# EAGLE design Steckkarte (EAGLE 9.5.2)
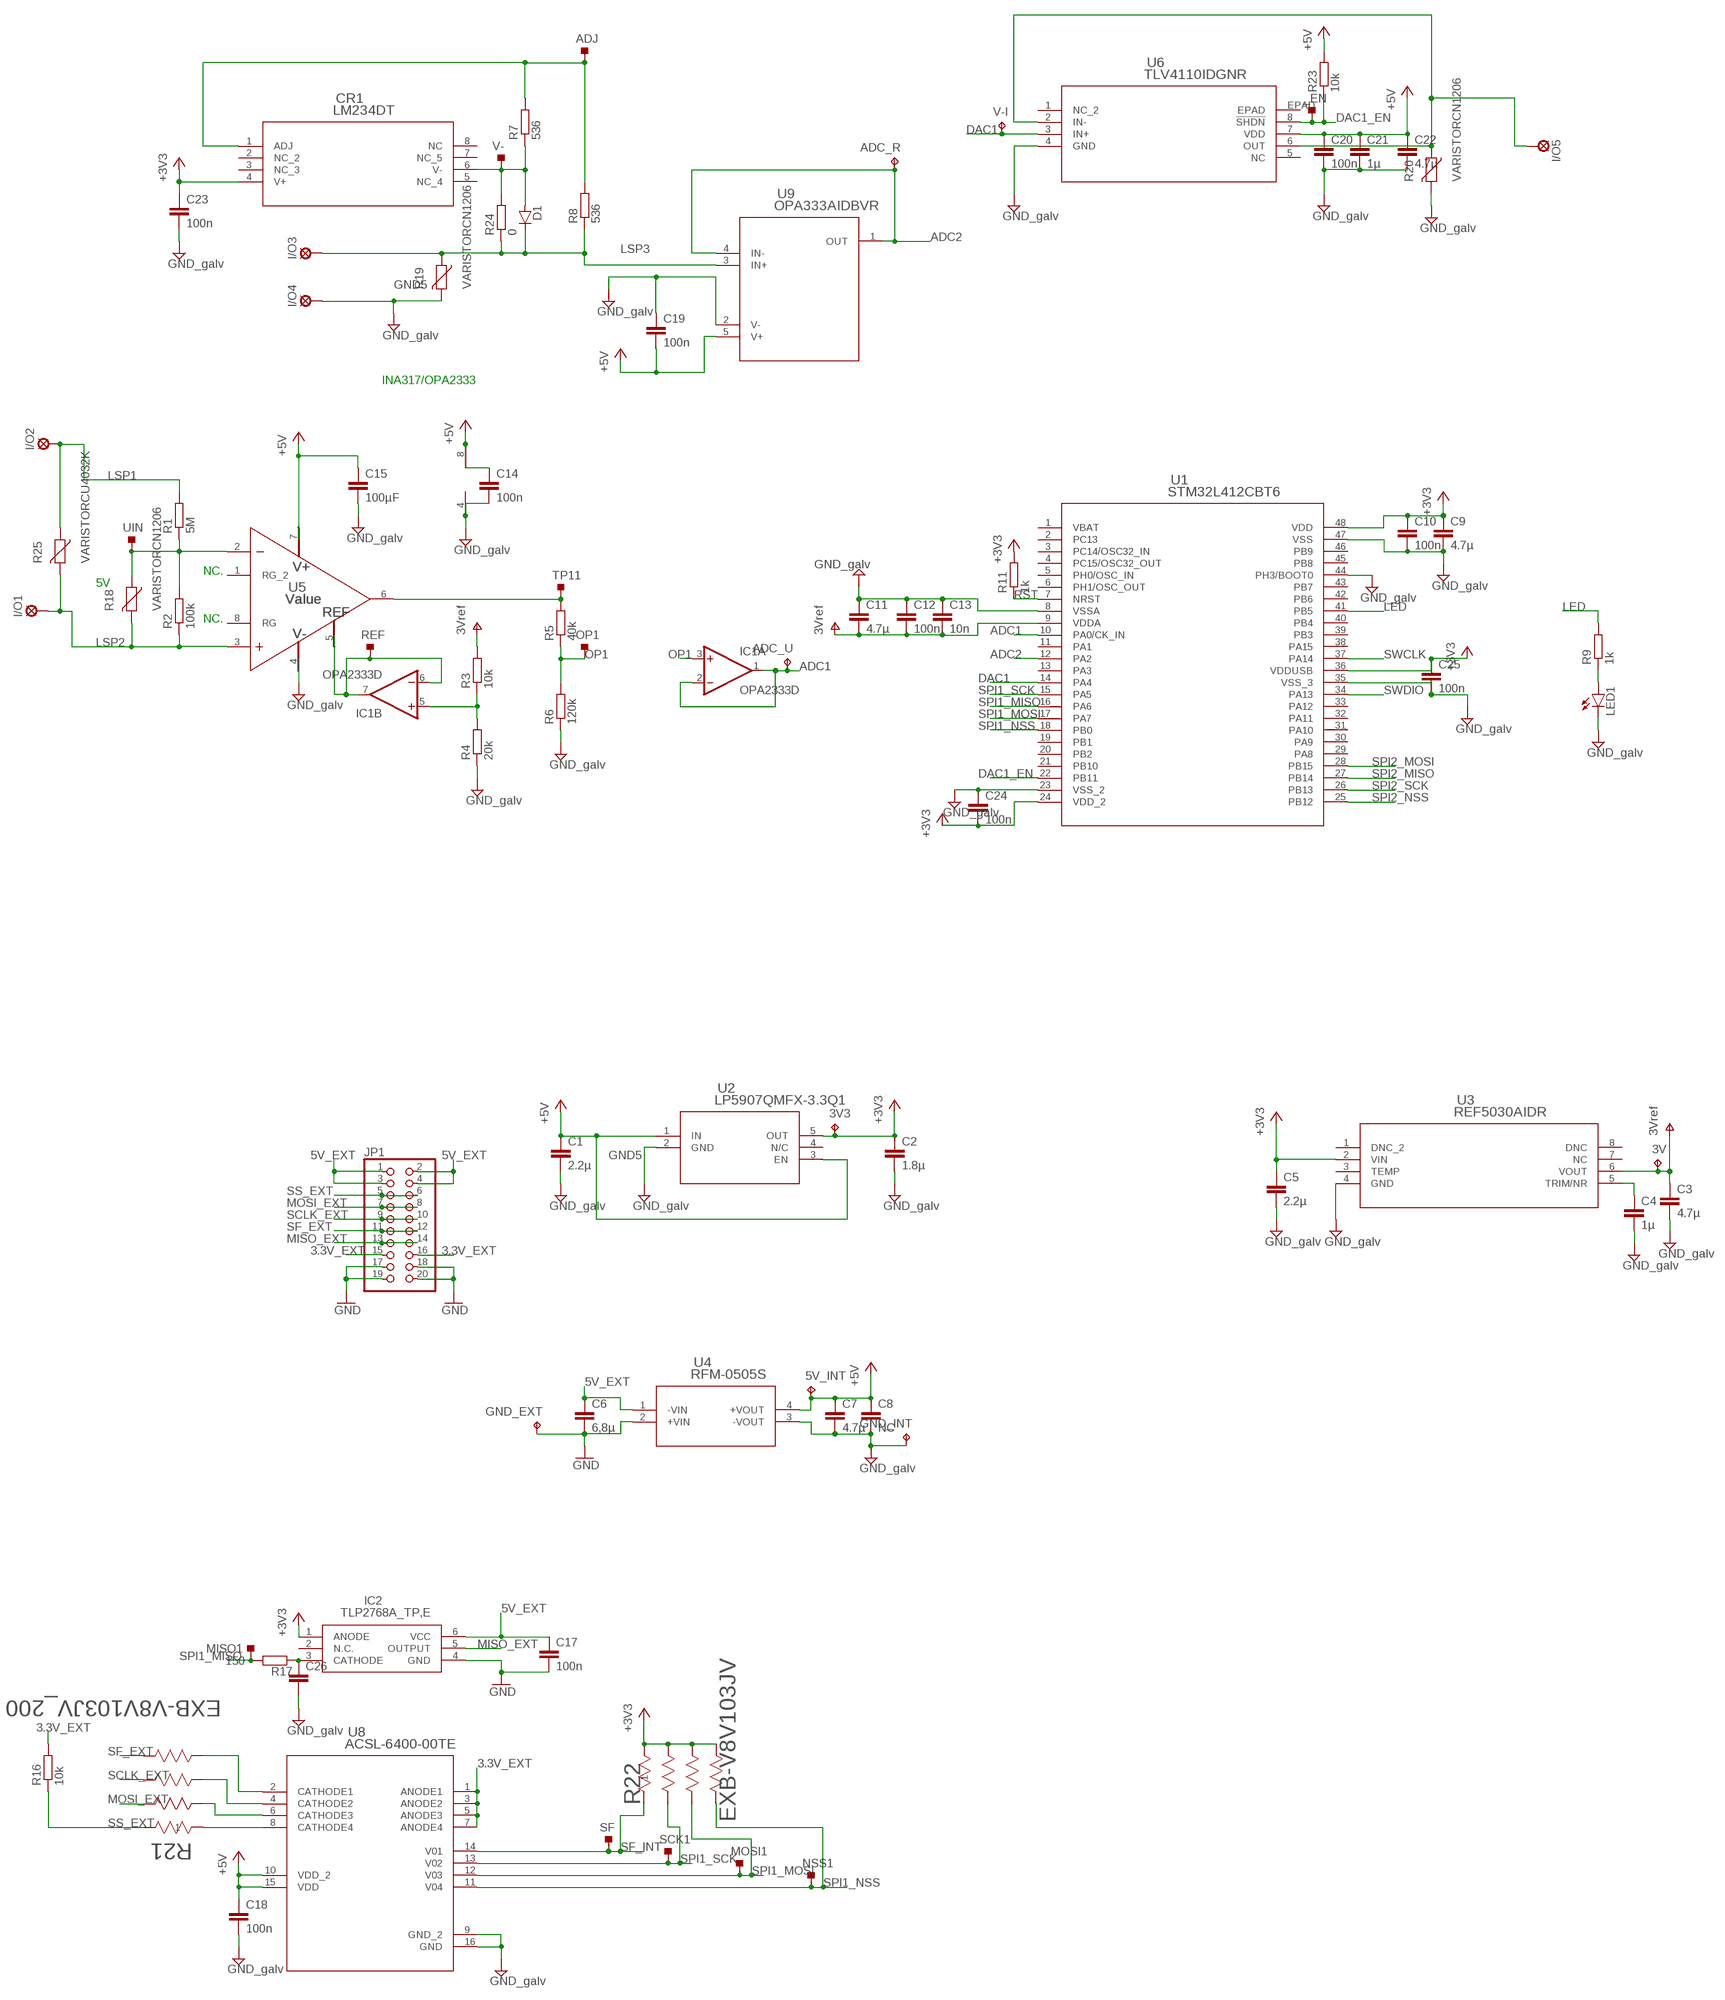
[diagram p0: schematic, sheet 1, part 1 of 2]
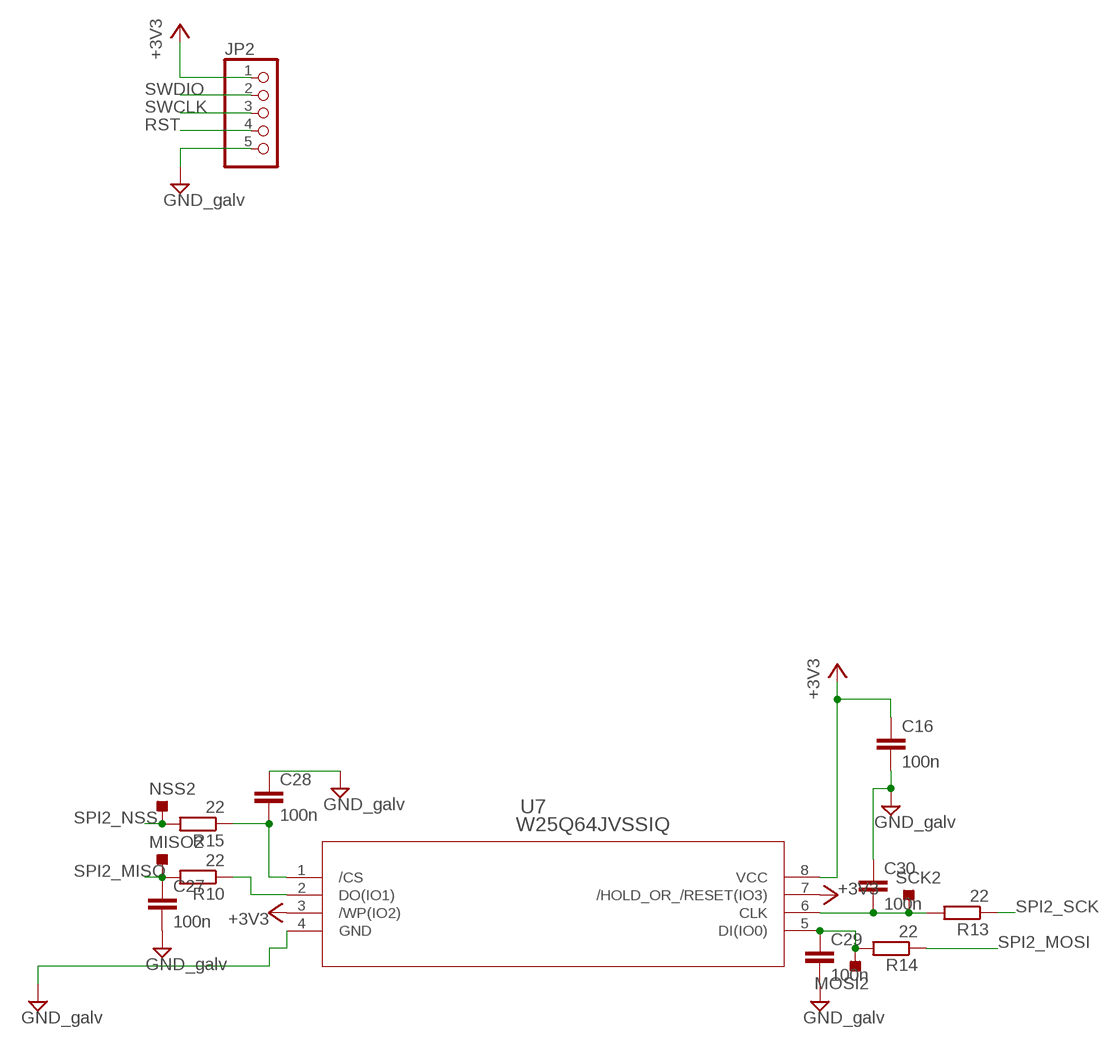
[diagram p1: schematic, sheet 1, part 2 of 2]

## Parts
3V  TPPAD1-13  [P1-13]
3V3  TPPAD1-13  [P1-13]
5V_INT  TPPAD1-13  [P1-13]
_EN  TESTPOINT_TPS-SMD-10SN  [TESTPOINT_SMD-10SN]
ADC_R  TPPAD1-13  [P1-13]
ADC_U  TPPAD1-13  [P1-13]
ADJ  TESTPOINT_TPS-SMD-10SN  [TESTPOINT_SMD-10SN]
C1  2.2µ  C-EUC0603K  [C0603K]
C2  1.8µ  C-EUC1206K  [C1206K]
C3  4.7µ  C-EUC0603K  [C0603K]
C4  1µ  C-EUC0603K  [C0603K]
C5  2.2µ  C-EUC0603K  [C0603K]
C6  6,8µ  C-EUC0603K  [C0603K]
C7  4.7µ  C-EUC0603K  [C0603K]
C8  NC  C-EUC0603K  [C0603K]
C9  4.7µ  C-EUC0603K  [C0603K]
C10  100n  C-EUC0603K  [C0603K]
C11  4.7µ  C-EUC0603K  [C0603K]
C12  100n  C-EUC0603K  [C0603K]
C13  10n  C-EUC0603K  [C0603K]
C14  100n  C-EUC0603K  [C0603K]
C15  100µF  C-EUC1206K  [C1206K]
C16  100n  C-EUC0603K  [C0603K]
C17  100n  C-EUC0603K  [C0603K]
C18  100n  C-EUC0603K  [C0603K]
C19  100n  C-EUC0603K  [C0603K]
C20  100n  C-EUC0603K  [C0603K]
C21  1µ  C-EUC0603K  [C0603K]
C22  4.7µ  C-EUC0603K  [C0603K]
C23  100n  C-EUC0603K  [C0603K]
C24  100n  C-EUC0603K  [C0603K]
C25  100n  C-EUC0603K  [C0603K]
C26  C-EUC0603K  [C0603K]
C27  100n  C-EUC0603K  [C0603K]
C28  100n  C-EUC0603K  [C0603K]
C29  100n  C-EUC0603K  [C0603K]
C30  100n  C-EUC0603K  [C0603K]
CR1  LM234DT  [SO-8]
D1  D-SOD123  [SOD123]
GND_EXT  TPPAD1-13  [P1-13]
GND_INT  TPPAD1-13  [P1-13]
I/O1  SE14  [SE14]
I/O2  SE14  [SE14]
I/O3  SE14  [SE14]
I/O4  SE14  [SE14]
I/O5  SE14  [SE14]
IC1  OPA2333D  [SO08]
IC2  TLP2768A_TP,E  [SOIC127P1000X220-6N]
JP1  PINHD-2X10/90  [2X10/90]
JP2  PINHD-1X5  [1X05]
LED1  LED5MM  [LED5MM]
MISO1  TESTPOINT_TPS-SMD-10SN  [TESTPOINT_SMD-10SN]
MISO2  TESTPOINT_TPS-SMD-10SN  [TESTPOINT_SMD-10SN]
MOSI1  TESTPOINT_TPS-SMD-10SN  [TESTPOINT_SMD-10SN]
MOSI2  TESTPOINT_TPS-SMD-10SN  [TESTPOINT_SMD-10SN]
NSS1  TESTPOINT_TPS-SMD-10SN  [TESTPOINT_SMD-10SN]
NSS2  TESTPOINT_TPS-SMD-10SN  [TESTPOINT_SMD-10SN]
OP1  TESTPOINT_TPS-SMD-10SN  [TESTPOINT_SMD-10SN]
R1  5M  R-EU_R1206  [R1206]
R2  100k  R-EU_R1206  [R1206]
R3  10k  R-EU_R0603  [R0603]
R4  20k  R-EU_R0603  [R0603]
R5  40k  R-EU_R0603  [R0603]
R6  120k  R-EU_R0603  [R0603]
R7  536  R-EU_R0603  [R0603]
R8  536  R-EU_R0603  [R0603]
R9  1k  R-EU_R0603  [R0603]
R10  22  R-EU_R0603  [R0603]
R11  1k  R-EU_R0603  [R0603]
R13  22  R-EU_R0603  [R0603]
R14  22  R-EU_R0603  [R0603]
R15  22  R-EU_R0603  [R0603]
R16  10k  R-EU_R0603  [R0603]
R17  150  R-EU_R0603  [R0603]
R18  VARISTORCN1206  [CT/CN1206]
R19  VARISTORCN1206  [CT/CN1206]
R20  VARISTORCN1206  [CT/CN1206]
R21  EXB-V8V103JV_200  EXB-V8V103JV  [EXBV8V]
R22  EXB-V8V103JV  [EXBV8V]
R23  10k  R-EU_R0603  [R0603]
R24  0  R-EU_R0603  [R0603]
R25  VARISTORCU4032K  [CU4032K]
REF  TESTPOINT_TPS-SMD-10SN  [TESTPOINT_SMD-10SN]
SCK1  TESTPOINT_TPS-SMD-10SN  [TESTPOINT_SMD-10SN]
SCK2  TESTPOINT_TPS-SMD-10SN  [TESTPOINT_SMD-10SN]
SF  TESTPOINT_TPS-SMD-10SN  [TESTPOINT_SMD-10SN]
TP11  TESTPOINT_TPS-SMD-10SN  [TESTPOINT_SMD-10SN]
U1  STM32L412CBT6  [LQFP-48]
U2  LP5907QMFX-3.3Q1  [DBV5]
U3  REF5030AIDR  [D8]
U4  RFM-0505S  [RFM-0505S]
U5  Value  INA317IDGKR  [DGK0008A_N]
U6  TLV4110IDGNR  [DGN8_1P89X1P57]
U7  W25Q64JVSSIQ  [SOIC-8_5P28X5P28]
U8  ACSL-6400-00TE  [SOIC_6400-00TE]
U9  OPA333AIDBVR  [DBV5]
UIN  TESTPOINT_TPS-SMD-10SN  [TESTPOINT_SMD-10SN]
V-  TESTPOINT_TPS-SMD-10SN  [TESTPOINT_SMD-10SN]
V-I  TPPAD1-13  [P1-13]

## Nets
3.3V_EXT: JP1.15 JP1.16 R16.2 U8.1(ANODE1) U8.3(ANODE2) U8.5(ANODE3) U8.7(ANODE4)
5V_EXT: C6.1 C17.1 IC2.6(VCC) JP1.1 JP1.2 JP1.3 JP1.4 U4.1(-VIN)
+3V3: 3V3.TP C2.1 C5.1 C9.1 C10.1 C16.1 C23.1 C24.2 C25.1 CR1.4(V+) IC2.1(ANODE) JP2.1 R11.2 R22.5 R22.6 R22.7 R22.8 U1.24(VDD_2) U1.36(VDDUSB) U1.48(VDD) U2.5(OUT) U3.2(VIN) U7.3(/WP(IO2)) U7.7(/HOLD_OR_/RESET(IO3)) U7.8(VCC)
+5V: 5V_INT.TP C1.1 C7.1 C8.1 C14.1 C15.1 C18.1 C19.2 C20.1 C21.1 C22.1 IC1.8(P:V+) R23.2 U2.1(IN) U2.3(EN) U4.4(+VOUT) U5.7(V+) U6.7(VDD) U8.10(VDD_2) U8.15(VDD) U9.5(V+)
ADC1: ADC_U.TP IC1.1(A:OUT) IC1.2(A:-IN) U1.10(PA0/CK_IN)
ADC2: ADC_R.TP U1.12(PA2) U9.1(OUT) U9.4(IN-)
DAC1: U1.14(PA4) U6.3(IN+) V-I.TP
DAC1_EN: _EN.TP R23.1 U1.22(PB11) U6.8(!SHDN)
GND: C6.2 C17.2 GND_EXT.TP IC2.4(GND) JP1.17 JP1.18 JP1.19 JP1.20 U4.2(+VIN)
GND5: C1.2 C2.2 C3.2 C4.2 C5.2 C7.2 C8.2 C9.2 C10.2 C11.1 C12.1 C13.1 C14.2 C15.2 C16.2 C18.2 C19.1 C20.2 C21.2 C22.2 C23.2 C24.1 C25.2 C26.2 C27.2 C28.1 C29.2 C30.1 GND_INT.TP I/O4.MP IC1.4(P:V-) JP2.5 LED1.K(C) R4.1 R6.1 R19.2 R20.2 U1.8(VSSA) U1.23(VSS_2) U1.35(VSS_3) U1.44(PH3/BOOT0) U1.47(VSS) U2.2(GND) U3.4(GND) U4.3(-VOUT) U5.4(V-) U6.4(GND) U7.4(GND) U8.9(GND_2) U8.16(GND) U9.2(V-) ; supply symbol labelled GND_galv
LED: R9.2 U1.41(PB5)
LSP1: I/O2.MP R1.2 R25.1
LSP2: I/O1.MP R2.1 R18.2 R25.2 U5.3(IN+)
LSP3: D1.1(C) I/O3.MP R8.1 R19.1 R24.1 U9.3(IN+)
LSP5: I/O5.MP R20.1 U6.2(IN-) U6.6(OUT)
MISO_EXT: IC2.5(OUTPUT) JP1.13 JP1.14
MOSI_EXT: JP1.7 JP1.8 R21.7
N$1: LED1.A R9.1
N$2: R1.1 R2.2 R18.1 U5.2(IN-) UIN.TP
N$3: R10.1 U7.2(DO(IO1))
N$4: R5.2 TP11.TP U5.6(OUT)
N$6: IC1.5(B:+IN) R3.1 R4.2
N$7: C4.1 U3.5(TRIM/NR)
N$8: IC1.6(B:-IN) IC1.7(B:OUT) REF.TP U5.5(REF)
N$9: R21.1 U8.8(CATHODE4)
N$11: CR1.6(V-) D1.2(A) R7.1 R24.2 V-.TP
N$12: ADJ.TP CR1.1(ADJ) R7.2 R8.2
N$13: C30.2 R13.2 SCK2.TP U7.6(CLK)
N$14: C29.1 MOSI2.TP R14.2 U7.5(DI(IO0))
N$15: C28.2 R15.1 U7.1(/CS)
N$16: R21.2 U8.6(CATHODE3)
N$17: R21.3 U8.4(CATHODE2)
N$18: R21.4 U8.2(CATHODE1)
N$19: C26.1 IC2.3(CATHODE) R17.1
OP1: IC1.3(A:+IN) OP1.TP R5.1 R6.2
RST: JP2.4 R11.1 U1.7(NRST)
SCLK_EXT: JP1.9 JP1.10 R21.6
SF_EXT: JP1.11 JP1.12 R21.5
SF_INT: R22.1 SF.TP U8.14(V01)
SPI1_MISO: MISO1.TP R17.2 U1.16(PA6)
SPI1_MOSI: MOSI1.TP R22.3 U1.17(PA7) U8.12(V03)
SPI1_NSS: NSS1.TP R22.4 U1.18(PB0) U8.11(V04)
SPI1_SCK: R22.2 SCK1.TP U1.15(PA5) U8.13(V02)
SPI2_MISO: C27.1 MISO2.TP R10.2 U1.27(PB14)
SPI2_MOSI: R14.1 U1.28(PB15)
SPI2_NSS: NSS2.TP R15.2 U1.25(PB12)
SPI2_SCK: R13.1 U1.26(PB13)
SS_EXT: JP1.5 JP1.6 R16.1 R21.8
SWCLK: JP2.3 U1.37(PA14)
SWDIO: JP2.2 U1.34(PA13)
V+: 3V.TP C3.1 C11.2 C12.2 C13.2 R3.2 U1.9(VDDA) U3.6(VOUT) ; supply symbol labelled 3Vref
Unconnected: CR1.2(NC_2) CR1.3(NC_3) CR1.5(NC_4) CR1.7(NC_5) CR1.8(NC) IC2.2(N.C.) U1.2(PC13) U1.3(PC14/OSC32_IN) U1.4(PC15/OSC32_OUT) U1.5(PH0/OSC_IN) U1.6(PH1/OSC_OUT) U1.11(PA1) U1.13(PA3) U1.19(PB1) U1.20(PB2) U1.21(PB10) U1.29(PA8) U1.30(PA9) U1.31(PA10) U1.32(PA11) U1.33(PA12) U1.38(PA15) U1.39(PB3) U1.40(PB4) U1.42(PB6) U1.43(PB7) U1.45(PB8) U1.46(PB9) U2.4(N/C) U3.1(DNC_2) U3.3(TEMP) U3.7(NC) U3.8(DNC) U5.1(RG_2) U5.8(RG) U6.1(NC_2) U6.5(NC) U6.EPAD

## Notes on the sheet
- INA317/OPA2333
- NC.
- 5V
- NC.

## Power pins joined to a net without a drawn wire
VBAT: U1.1(VBAT)

## Library data of the parts
3V 3V3 5V_INT ADC_R ADC_U GND_EXT GND_INT V-I = testpad:TP: Test pad
_EN ADJ MISO1 MISO2 MOSI1 MOSI2 NSS1 NSS2 OP1 REF SCK1 SCK2 SF TP11 UIN V- = 52101-101-REV-A:TESTPOINT_TPS: TEST POINT PAD; BOM: EXCLUDE
C1-C5 C9-C14 C16-C30 = rcl:C-EU: CAPACITOR, European symbol; SPICEPREFIX: C
C6-C8 C15 = resistor:C-EU: CAPACITOR, European symbol
CR1 = LM234:LM234DT; BUILT_BY: EMA_UL_Team; MANUFACTURER_PART_NUMBER: LM234DT; VENDOR: STMicroelectronics
D1 = semicon-smd-ipc:D-: DIODE unfilled
I/O1-I/O5 = solpad:SE14: SOLDER PAD E1553, drill 1,4mm, distributor Buerklin, 07F820
IC1 = linear:OPA2333: DUAL 1.8V, microPOWER CMOS OPERATIONAL AMPLIFIERS Zerø-Drift Series Source: Texas Instruments (Burr-Brown) .. U11 opa333 Operational Amp.pdf
IC2 = SamacSys_Parts:TLP2768A_TP,E: High Speed Optocouplers High-Speed (20 Mbps) IC Photocoupler Source: Datasheet <https://componentsearchengine.com/Datasheets/1/TLP2768A(TP,E.pdf>; DESCRIPTION: High Speed Optocouplers High-Speed (20 Mbps) IC Photocoupler; HEIGHT: 2.2mm; MANUFACTURER_NAME: Toshiba; MANUFACTURER_PART_NUMBER: TLP2768A(TP,E; MOUSER_PART_NUMBER: 757-TLP2768ATPE; MOUSER_PRICE-STOCK: https://www.mouser.com/Search/Refine.aspx?Keyword=757-TLP2768ATPE
JP1 = pinhead:PINHD-2X10: PIN HEADER
JP2 = pinhead:PINHD-1X5: PIN HEADER
LED1 = led:LED: LED OSRAM: - CHIPLED LG R971, LG N971, LY N971, LG Q971, LY Q971, LO R971, LY R971 LH N974, LH R974 LS Q976, LO Q976, LY Q976 LO Q996 - Hyper CHIPLED LW Q18S LB Q993, LB Q99A, LB R99A - SideLED LS A670, LO A670, LY A670, LG A670, LP A670 LB A673, LV A673, LT A673, LW A673 LH A674 LY A675 LS A676, LA A676, LO A676, LY A676, LW A676 LS A679, LY A679, LG A679 - Hyper Micro SIDELED® LS Y876, LA Y876, LO Y876, LY Y876 LT Y87S - SmartLED LW L88C, LW L88S LB L89C, LB L89S, LG L890 LS L89K, LO L89K, LY L89K LS L896, LA L896, LO L896, LY L896 - TOPLED LS T670, LO T670, LY T670, LG T670, LP T670 LSG T670, LSP T670, LSY T670, LOP T670, LYG T670 LG T671, LOG T671, LSG T671 LB T673, LV T673, LT T673, LW T673 LH T674 LS T676, LA T676, LO T676, LY T676, LB T676, LH T676, LSB T676, LW T676 LB T67C, LV T67C, LT T67C, LS T67K, LO T67K, LY T67K, LW E67C LS E67B, LA E67B, LO E67B, LY E67B, LB E67C, LV E67C, LT E67C LW T67C LS T679, LY T679, LG T679 LS T770, LO T770, LY T770, LG T770, LP T770 LB T773, LV T773, LT T773, LW T773 LH T774 LS E675, LA E675, LY E675, LS T675 LS T776, LA T776, LO T776, LY T776, LB T776 LHGB T686 LT T68C, LB T68C - Hyper Mini TOPLED® LB M676 - Mini TOPLED Santana® LG M470 LS M47K, LO M47K, LY M47K Source: http://www.osram.convergy.de LUXEON: - LUMILED® LXK2-PW12-R00, LXK2-PW12-S00, LXK2-PW14-U00, LXK2-PW14-V00 LXK2-PM12-R00, LXK2-PM12-S00, LXK2-PM14-U00 LXK2-PE12-Q00, LXK2-PE12-R00, LXK2-PE12-S00, LXK2-PE14-T00, LXK2-PE14-U00 LXK2-PB12-K00, LXK2-PB12-L00, LXK2-PB12-M00, LXK2-PB14-N00, LXK2-PB14-P00, LXK2-PB14-Q00 LXK2-PR12-L00, LXK2-PR12-M00, LXK2-PR14-Q00, LXK2-PR14-R00 LXK2-PD12-Q00, LXK2-PD12-R00, LXK2-PD12-S00 LXK2-PH12-R00, LXK2-PH12-S00 LXK2-PL12-P00, LXK2-PL12-Q00, LXK2-PL12-R00 Source: www.luxeon.com KINGBRIGHT: KA-3528ASYC Source: www.kingbright.com
R1-R11 R13-R17 R23 R24 = rcl:R-EU_: RESISTOR, European symbol; SPICEPREFIX: R
R18-R20 R25 = varistor:VARISTOR: VARISTOR
R21 R22 = EXB-V8V103:EXB-V8V103JV; BUILT_BY: EMA_UL_Team; MANUFACTURER_PART_NUMBER: EXB-V8V103JV; VENDOR: Panasonic
U1 = stm32l412CB6T:STM32L412CBT6; BUILT_BY: EMA_Jessica; COPYRIGHT: Copyright (C) 2018 Accelerated Designs. All rights reserved; MANUFACTURER_PART_NUMBER: STM32L412CBT6; VENDOR: STMicroelectronics
U2 = LP5907:LP5907QMFX-3.3Q1; BUILT_BY: EMA_UL_Team; MANUFACTURER_PART_NUMBER: LP5907QMFX-3.3Q1; VENDOR: Texas Instruments
U3 = REF5030:REF5030AIDR; BUILT_BY: EMA_UL_Team; MANUFACTURER_PART_NUMBER: REF5030AIDR; VENDOR: Texas Instruments
U4 = RFM0505S:RFM-0505S; BUILT_BY: EMA_Cory; COPYRIGHT: Copyright (C) 2018 Accelerated Designs. All rights reserved; MANUFACTURER_PART_NUMBER: RFM-0505S; VENDOR: Recom Power
U5 = ina317:INA317IDGKR; MANUFACTURER: Texas Instruments; PARTNUMBER: INA317IDGKR; REFDES: RefDes; TYPE: TYPE
U6 = TLV4110:TLV4110IDGNR; DATASHEET_URL: http://www.ti.com/lit/gpn/TLV4110; DESCRIPTION: High Output Drive, Low Voltage, Single Operational Amplifier w/Shutdown; FAMILY_NAME: HIGH OUTPUT CURRENT; GENERIC_PART_NUMBER: TLV4110; INDUSTRY_STD_PKG_TYPE: MSOP-PowerPAD; MANUFACTURER: Texas Instruments; MANUFACTURER_PART_NUMBER: TLV4110IDGNR; PACKAGE_DESIGNATOR: DGN; PIN_COUNT: 8; VENDOR: Texas Instruments
U7 = W25Q64JVSSIQ:W25Q64JVSSIQ; BUILT_BY: EMA_Anthony; COPYRIGHT: Copyright (C) 2018 Accelerated Designs. All rights reserved; MANUFACTURER_PART_NUMBER: W25Q64JVSSIQ; VENDOR: Winbond
U8 = ACSL-6400:ACSL-6400-00TE; BUILT_BY: EMA_Matt; COPYRIGHT: Copyright (C) 2018 Accelerated Designs. All rights reserved; MANUFACTURER_PART_NUMBER: ACSL-6400-00TE; VENDOR: Broadcom
U9 = OPA2333ADBV:OPA333AIDBVR; DATASHEET_URL: http://www.ti.com/lit/gpn/OPA333; DESCRIPTION: 1.8V, 17µA, microPower, Precision, Zero Drift CMOS Op Amp; FAMILY_NAME: LOW OFFSET VOLTAGE; GENERIC_PART_NUMBER: OPA333; INDUSTRY_STD_PKG_TYPE: SOT-23; MANUFACTURER: Texas Instruments; MANUFACTURER_PART_NUMBER: OPA333AIDBVR; PACKAGE_DESIGNATOR: DBV; PIN_COUNT: 5; VENDOR: Texas Instruments

## Board
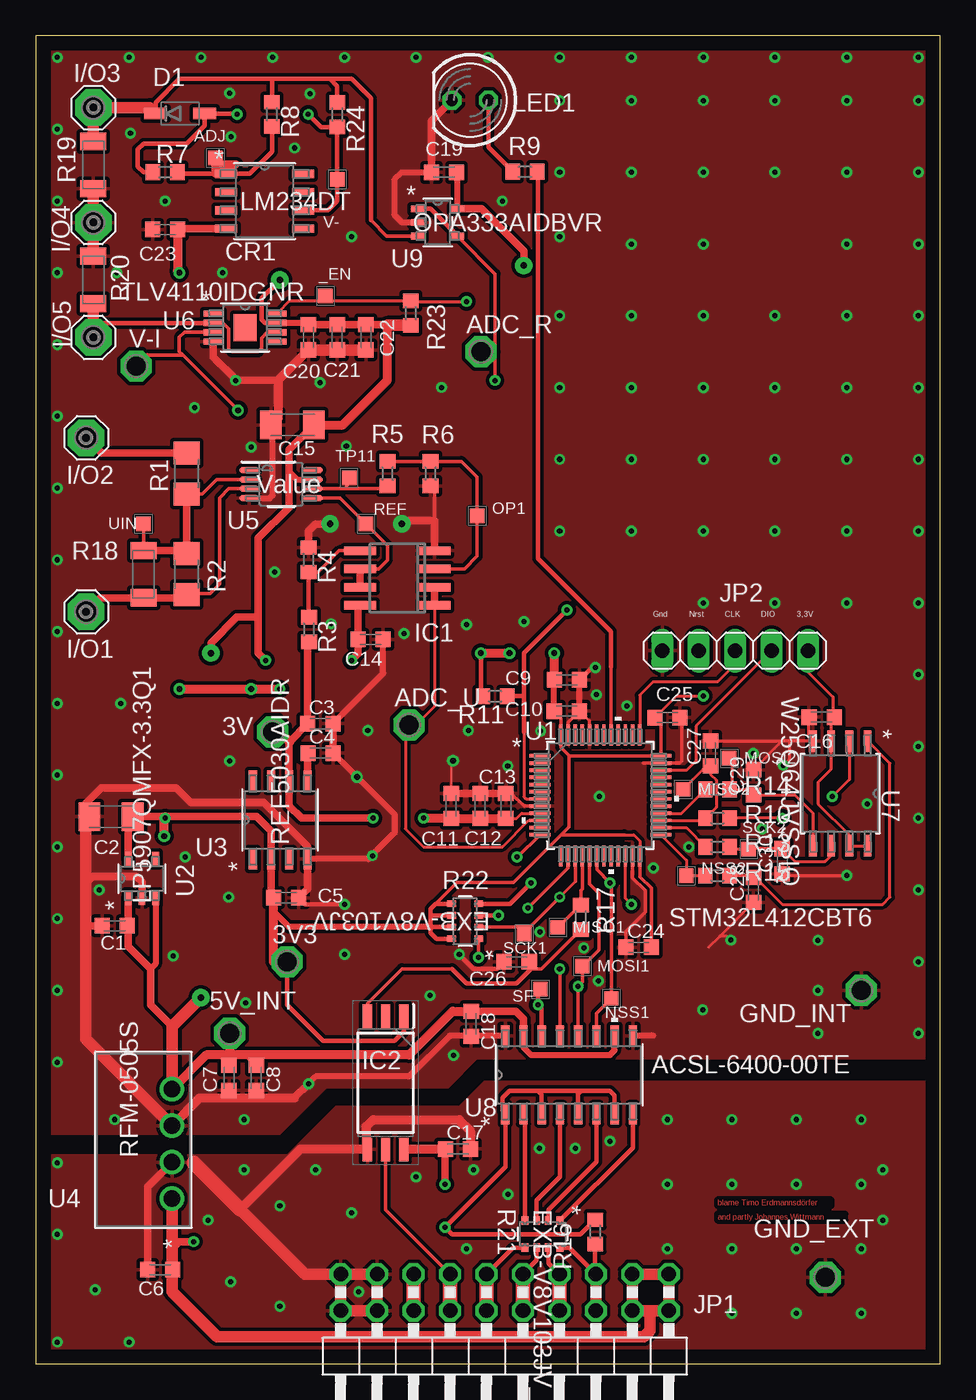
[diagram p2: board, top side]
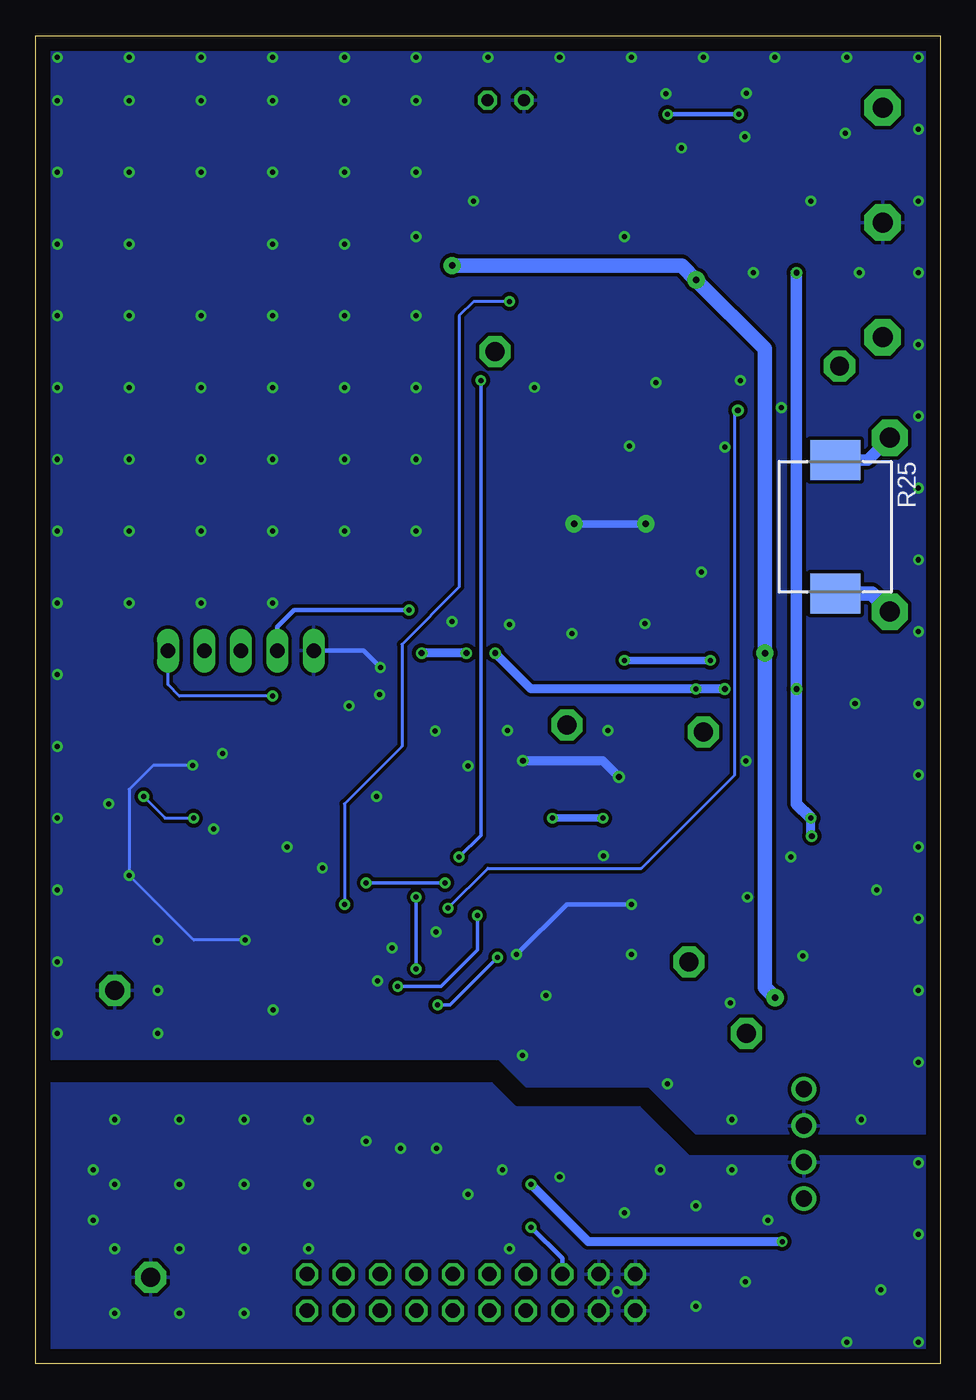
[diagram p3: board, bottom side, seen from below]

Size 63 x 92.5 mm. Coordinates in mm from the lower left corner, seen from the top.
Outline: 0,0 63,0 63,92.5 0,92.5 0,0
Copper layers (1*16): Top 0.035mm / dielectric 1.5mm / Bottom 0.035mm
Design rules "default": minimum track width 6mil, minimum drill 0.35mm, track to track 6mil, track to pad 6mil, pad to pad 6mil, via to via 6mil, smd to smd 6mil, copper to edge 40mil, drill to drill 6mil, minimum pad ring 10mil, minimum via ring 8mil, stop-mask expansion 4mil, vias tented up to drill 0mil, thermal gap 10mil

### Footprints (pad centres in the part's own frame; a part is rotated, then mirrored left to right if it is on the bottom)
P1-13 = drill 1.321 pad 2.159 octagon: TP 0,0
TESTPOINT_SMD-10SN = smd 1 x 1: TP 0,0
C0603K = smd 1.05 x 1.08: 1 -0.875,0; 2 0.875,0
C1206K = smd 1.5 x 2: 1 -1.5,0; 2 1.5,0
SO-8 = smd 1.538 x 0.568: 1 -2.68,1.905; 2 -2.68,0.635; 3 -2.68,-0.635; 4 -2.68,-1.905; 5 2.68,-1.905; 6 2.68,-0.635; 7 2.68,0.635; 8 2.68,1.905
SOD123 = smd 1.6 x 0.8: 1 -1.7,0; 2 1.7,0
SE14 = drill 1.397 pad 2.54 octagon: MP 0,0
SO08 = smd 0.6 x 2.2: 1 -1.905,-2.6; 2 -0.635,-2.6; 3 0.635,-2.6; 4 1.905,-2.6; 5 1.905,2.6; 6 0.635,2.6; 7 -0.635,2.6; 8 -1.905,2.6
SOIC127P1000X220-6N = smd 1.65 x 0.65: 1 -4.65,1.27; 2 -4.65,0; 3 -4.65,-1.27; 4 4.65,-1.27; 5 4.65,0; 6 4.65,1.27
2X10/90 = drill 1.016 octagon: 1 -11.43,-6.35; 2 -11.43,-3.81; 3 -8.89,-6.35; 4 -8.89,-3.81; 5 -6.35,-6.35; 6 -6.35,-3.81; 7 -3.81,-6.35; 8 -3.81,-3.81; 9 -1.27,-6.35; 10 -1.27,-3.81; 11 1.27,-6.35; 12 1.27,-3.81; 13 3.81,-6.35; 14 3.81,-3.81; 15 6.35,-6.35; 16 6.35,-3.81; 17 8.89,-6.35; 18 8.89,-3.81; 19 11.43,-6.35; 20 11.43,-3.81
1X05 = drill 1.016 long: 1 -5.08,0; 2 -2.54,0; 3 0,0; 4 2.54,0; 5 5.08,0
LED5MM = drill 0.813 octagon: A -1.27,0; K 1.27,0
R1206 = smd 1.6 x 1.803: 1 -1.422,0; 2 1.422,0
R0603 = smd 1 x 1.1: 1 -0.85,0; 2 0.85,0
CT/CN1206 = smd 1.2 x 1.8: 1 -1.65,0; 2 1.65,0
EXBV8V = smd 0.609 x 0.47: 1 -0.946,1.219; 2 -0.946,0.406; 3 -0.946,-0.406; 4 -0.946,-1.219; 5 0.946,-1.219; 6 0.946,-0.406; 7 0.946,0.406; 8 0.946,1.219
CU4032K = smd 2.8 x 3.5: 1 -4.65,0; 2 4.65,0
LQFP-48 = smd 1.462 x 0.239: 1 -4.216,2.75; 2 -4.216,2.25; 3 -4.216,1.75; 4 -4.216,1.25; 5 -4.216,0.75; 6 -4.216,0.25; 7 -4.216,-0.25; 8 -4.216,-0.75; 9 -4.216,-1.25; 10 -4.216,-1.75; 11 -4.216,-2.25; 12 -4.216,-2.75; 25 4.216,-2.75; 26 4.216,-2.25; 27 4.216,-1.75; 28 4.216,-1.25; 29 4.216,-0.75; 30 4.216,-0.25; 31 4.216,0.25; 32 4.216,0.75; 33 4.216,1.25; 34 4.216,1.75; 35 4.216,2.25; 36 4.216,2.75 | smd 0.239 x 1.462: 13 -2.75,-4.216; 14 -2.25,-4.216; 15 -1.75,-4.216; 16 -1.25,-4.216; 17 -0.75,-4.216; 18 -0.25,-4.216; 19 0.25,-4.216; 20 0.75,-4.216; 21 1.25,-4.216; 22 1.75,-4.216; 23 2.25,-4.216; 24 2.75,-4.216; 37 2.75,4.216; 38 2.25,4.216; 39 1.75,4.216; 40 1.25,4.216; 41 0.75,4.216; 42 0.25,4.216; 43 -0.25,4.216; 44 -0.75,4.216; 45 -1.25,4.216; 46 -1.75,4.216; 47 -2.25,4.216; 48 -2.75,4.216
DBV5 = smd 0.972 x 0.468: 1 -1.362,0.95; 2 -1.362,0; 3 -1.362,-0.95; 4 1.362,-0.95; 5 1.362,0.95
D8 = smd 1.455 x 0.568: 1 -2.721,1.905; 2 -2.721,0.635; 3 -2.721,-0.635; 4 -2.721,-1.905; 5 2.721,-1.905; 6 2.721,-0.635; 7 2.721,0.635; 8 2.721,1.905
RFM-0505S = drill 1.143 pad 1.651: 1 0,0; 2 2.54,0; 3 5.08,0; 4 7.62,0
DGK0008A_N = smd 1.35 x 0.45: 1 -2.225,0.975; 2 -2.225,0.325; 3 -2.225,-0.325; 4 -2.225,-0.975; 5 2.225,-0.975; 6 2.225,-0.325; 7 2.225,0.325; 8 2.225,0.975
DGN8_1P89X1P57 = smd 1.328 x 0.441: 1 -2.213,0.975; 2 -2.213,0.325; 3 -2.213,-0.325; 4 -2.213,-0.975; 5 2.213,-0.975; 6 2.213,-0.325; 7 2.213,0.325; 8 2.213,0.975 | smd 1.57 x 1.89: EPAD 0,0
SOIC-8_5P28X5P28 = smd 1.513 x 0.543: 1 -3.645,1.905; 2 -3.645,0.635; 3 -3.645,-0.635; 4 -3.645,-1.905; 5 3.645,-1.905; 6 3.645,-0.635; 7 3.645,0.635; 8 3.645,1.905
SOIC_6400-00TE = smd 1.455 x 0.568: 1 -2.721,4.445; 2 -2.721,3.175; 3 -2.721,1.905; 4 -2.721,0.635; 5 -2.721,-0.635; 6 -2.721,-1.905; 7 -2.721,-3.175; 8 -2.721,-4.445; 9 2.721,-4.445; 10 2.721,-3.175; 11 2.721,-1.905; 12 2.721,-0.635; 13 2.721,0.635; 14 2.721,1.905; 15 2.721,3.175; 16 2.721,4.445

### Placement (x,y rotation side)
3V  16.5,44 0 top
3V3  17.5,28 0 top
5V_INT  13.5,23 0 top
_EN  20.18,74.38 0 top
ADC_R  31,70.5 0 top
ADC_U  26,44.5 0 top
ADJ  12.5,84 0 top
C1  5.5,30.5 180 top
C2  5.25,38.11 180 top
C3  19.82,44.58 0 top
C4  19.83,42.54 0 top
C5  17.43,32.46 0 top
C6  8.65,6.54 180 top
C7  13.46,19.91 270 top
C8  15.36,19.91 270 top
C9  37,47.63 0 top
C10  36.99,45.46 0 top
C11  28.94,38.85 270 top
C12  30.96,38.84 270 top
C13  32.75,38.85 270 top
C14  23.33,50.46 0 top
C15  17.88,65.4 180 top
C16  54.75,45.04 180 top
C17  29.41,14.96 0 top
C18  30.33,23.66 270 top
C19  28.44,82.99 0 top
C20  19,71.5 270 top
C21  21,71.5 270 top
C22  23,71.5 270 top
C23  9,79 180 top
C24  42,29 0 top
C25  44,45 0 top
C26  33.5,28 180 top
C27  47,42.5 90 top
C28  50,33 90 top
C29  50,40.5 90 top
C30  52,35 90 top
CR1  15.94,80.98 0 top
D1  10.05,87.09 0 top
GND_EXT  55,6 0 top
GND_INT  57.5,26 0 top
I/O1  3.5,52.38 0 top
I/O2  3.5,64.5 0 top
I/O3  4,87.5 0 top
I/O4  4,79.5 0 top
I/O5  4,71.5 0 top
IC1  25.19,54.73 90 top
IC2  24.37,19.57 270 top
JP1  32.67,-0.12 180 top
JP2  48.72,49.67 180 top
LED1  30.26,88.02 180 top
MISO1  36.37,30.38 0 top
MISO2  45.09,40 0 top
MOSI1  38.08,27.68 0 top
MOSI2  48.32,42.17 0 top
NSS1  40.11,25.44 0 top
NSS2  45.33,33.98 0 top
OP1  30.75,59.06 0 top
R1  10.5,62 90 top
R2  10.5,55 90 top
R3  19.03,51.15 270 top
R4  19,56 270 top
R5  24.5,62 270 top
R6  27.5,62 90 top
R7  9,83 0 top
R8  16.44,87.03 270 top
R9  34.09,83.03 0 top
R10  47.5,38 180 top
R11  32,46.5 180 top
R13  47.5,36 0 top
R14  47.5,40 0 top
R15  47.5,34 180 top
R16  38.97,9.17 90 top
R17  37.97,31.09 90 top
R18  7.5,55 270 top
R19  4,83.5 270 top
R20  4,75.5 90 top
R21  35.3,9.03 270 top
R22  29.91,30.82 180 top
R23  26.12,73.19 270 top
R24  21,87 270 top
R25  7.3,58.3 270 bottom
REF  23,58.5 0 top
SCK1  34.02,29.93 0 top
SCK2  49.67,35.83 0 top
SF  35.16,26.08 0 top
TP11  21.83,61.7 0 top
U1  39.33,39.59 0 top
U2  7.39,33.79 90 top
U3  17.02,37.87 90 top
U4  9.49,11.5 90 top
U5  17.09,61.27 0 top
U6  14.58,72.18 0 top
U7  56.05,39.72 270 top
U8  37.15,20.12 90 top
U9  28,79.5 0 top
UIN  7.5,58.5 0 top
V-  21,82.5 0 top
V-I  7,69.5 0 top

### Tracks (layer width: path | path; a pad name or v marks a point on that pad's centre or on a via)
3.3V_EXT  (via drill 0.35)
  Top 0.305: R16.2 37.95,9 29,9 v28.5,9.5 32.7,13.71 U8.1 32.5,17.6 32.5,18.5 33,19 35,19 | U8.7 40.33,18.68 40,19 38,19 | 38,19 35,19 | U8.3 35.24,18.75 35,19 | U8.5 37.78,18.79 38,19
  Top 1.016: JP1.16 JP1.15
  Bottom 0.305: JP1.15 26.32,7.32 v28.5,9.5
5V_EXT  (via drill 0.35)
  Top 0.508: v11,8.5 10,8.5 9.5,8 | v28.5,12.5 28.5,14.99 C17.1
  Top 0.61: C17.1 28.42,14.92 IC2.6
  Top 0.813: 9.5,6.51 9.5,5 12.62,1.88 42.38,1.88 42.8,2.3 42.8,3.69 | 9.5,6.51 C6.1 | 9.5,6.51 9.5,8 U4.1 | 42.8,3.69 JP1.4 JP1.3 JP1.1 JP1.2 42.8,3.69
  Bottom 0.61: v11,8.5 24.5,8.5 v28.5,12.5
+3V3  (via drill 0.35, 0.4 pad 0.8)
  Top 0.2: 36.08,45.42 C10.1
  Top 0.203: U7.8 U7.7 56.69,36.81 54.5,39 54.5,40.5 55.41,41.41 U7.3 55.41,44.83 55.54,44.96 | 55.54,44.96 C16.1 | JP2.1 53.8,48.2 55.54,46.46 55.54,44.96 | C25.1 44.62,46.5 v46.5,46.5 | 41,36.83 41.67,36.83 42.08,36.42 U1.24
  Top 0.254: 36.08,45.42 36.58,44.92 U1.48 36.58,42.93 37.17,42.34 | 27.8,31.99 29.33,33.52 33.27,33.52 36.58,36.83 | C25.1 43.55,44.58 U1.36 37.17,42.34 | 36.58,36.83 41,36.83 | 37.17,42.34 37.13,42.34 37.13,37.38 36.58,36.83 | U1.24 42.08,33.92 42.88,33.12 C24.2
  Top 0.305: R22.8 27.9,29.6 27.5,30 27.5,30.46 | 27.5,30.46 27.5,31.23 | 27.5,31.23 27.5,31.69 27.8,31.99 27.85,32.04 R22.5 | R22.6 27.5,31.23 | 27.5,31.23 | R22.7 27.55,30.41 27.5,30.46 | IC2.1 25.64,23.14 25,22.5 20,22.5 17.5,25 3V3.TP | R11.2 31,46.65 v31,49.5
  Top 0.406: C9.1 36.12,47.62 C10.1 | 27.55,30.41 17.64,30.41 16.55,31.5
  Top 0.508: C5.1 16.38,32.63 U3.2 16.38,37.12 15.39,38.11 9,38.11 C2.1 6.44,37.8 U2.5 | C23.1 9.95,79.08 CR1.4
  Top 0.61: C5.1 16.55,31.5 16.55,28 3V3.TP | C23.1 9.88,76.12 v10,76 | v8.94,36.75 8.94,38.04 9,38.11 | C9.1 v36.12,49.5 | v10,47 v15,47 v17,47 | v31,49.5 32.86,49.5 32.88,49.51 32.99,49.51 v33,49.5
  Bottom 0.203: v46.5,46.5 53,46.5 53.8,47.3 JP2.1
  Bottom 0.61: v8.94,36.75 9,36.81 v9,38 | v31,49.5 28.5,47 v17,47 v15,47 | v33,49.5 v36.12,49.5
  Bottom 0.813: v10,76 v10,47 10,39 v9,38
+5V  (via drill 0.35, 0.45 pad 1.2)
  Top 0.305: U6.7 15.98,72.5 15.74,72.74 15.74,74.24 v17,75.5
  Top 0.406: U5.7 18.21,61.59 17.64,62.16 | C19.2 29.23,82.91 29.36,82.78 U9.5 | C20.1 18.87,72.5 U6.7 | C7.1 13.5,20.82 13.5,21.5 14.65,21.5 C8.1 15.36,21.36 15.5,21.5 | U2.3 8.34,27.84 8,27.5 | 30.29,24.5 C18.1 | U8.15 34,22.82 34,22 34.5,21.5 40,21.5 40.33,21.82 U8.10
  Top 0.508: IC1.8 22.45,52.69 C14.1 22.45,49.45 v22,49 | U2.1 6.44,30.57 | 6.44,30.57 6.44,29.06 8,27.5 8,24.98 9.49,23.49 | 15.5,52 14,52 12.2,50.2 v12.2,49.5 | 15.5,52 15.5,57.5 17.64,59.65 17.64,62.16 17.64,63.66 C15.1 | U9.5 31.05,80.45 34,77.5 v34,76.5 | C18.1 33.46,24.54 33.98,24.02 U8.15 | v16,49 15.5,49.5 15.5,52 | C1.1 6.44,30.57 | C20.1 C21.1 C22.1 24.46,72.38 24.5,72.34
  Top 0.61: U4.4 11.87,21.5 13.5,21.5 | 13.5,21.5 15.5,21.5 26.01,21.5 29.05,24.54 30.25,24.54 30.29,24.5 | C15.1 21.38,65.4 24.5,68.52 24.5,72.34 | 5V_INT.TP 13.5,21.5
  Top 0.813: R23.2 24.5,72.34 | v11.5,25.5 9.49,23.49 U4.4
  Bottom 0.508: v22,49 v16,49
  Bottom 1.016: v34,76.5 18,76.5 v17,75.5 12.2,70.7 v12.2,49.5 12.2,26.2 v11.5,25.5
ADC1
  Top 0.203: IC1.1 27.79,45.79 26.5,44.5 25.75,43.75 25.75,37.25 27,36 32.5,36 34.34,37.84 U1.10
  Top 0.254: ADC_U.TP 26.5,44.5
  Top 0.508: IC1.1 IC1.2
ADC2  (via drill 0.35, 0.35 pad 0.2)
  Top 0.254: U1.12 33.56,35.29 v33.51,35.29 | v32,68.5 32,70.5 | 32,70.5 32,75.91 U9.4 | ADC_R.TP 32,70.5
  Top 0.305: U9.1 27.5,80.45 29.36,78.59
  Top 0.406: 29.36,78.59 U9.4
  Bottom 0.254: v33.51,35.29 32,36.8 v32,68.5
DAC1  (via drill 0.35, 0.4 pad 0.8)
  Top 0.254: U6.3 10.36,71.86 10,71.5 10,70.5 10.25,70.25 | 10.25,70.25 v14.08,66.42 | 10.25,70.25 7.75,70.25 | v34.27,31.73 37.08,34.54 U1.14
  Top 0.305: 7.75,70.25 V-I.TP
  Top 0.406: v14.08,66.42
  Bottom 0.203: v34.27,31.73 31.51,34.5 20.81,34.5 14.32,40.99 14.32,66.18 v14.08,66.42
DAC1_EN  (via drill 0.35)
  Top 0.203: 26.16,74 v30,74 | U6.8 17.68,74.04 19.83,74.04 | 20.52,74.04 R23.1 | v41.5,32 41.08,32.42 U1.22
  Top 0.254: R23.1 26.16,74 | 19.83,74.04 _EN.TP 20.52,74.04
  Bottom 0.203: v30,74 32.5,74 33.5,73 33.5,54.1 37.5,50.1 37.5,43 41.5,39 v41.5,32
GND  (via drill 0.35, 0.35 pad 0.2)
  Top 0.508: C6.2 7.78,12.32 U4.2
  Top 0.61: 14.24,10.76 18.43,14.96 23.06,14.96 | 23.06,14.96 IC2.4 | 23.06,14.96 23,15.02 23,16.5 23.5,17 29.5,17 30.28,16.22 C17.2
  Top 0.813: JP1.19 JP1.17 JP1.18 JP1.20 JP1.19 | JP1.19 18.77,6.23 14.24,10.76
  Top 1.016: 11,14 14.24,10.76
  other vias: 17,11 17,4 12,10 1.5,14 1.5,9 1.5,1.5 6.5,1.5 57.5,3.5 30,8 30.5,13.5 53,3.5 57.5,8 53,8 57.5,12.5 57.5,17 59,13.5 53,12.5 59,10 44,12.5 40,15.5 48.5,8 22,10.5 14.5,13.5 48.5,12.5 48.5,17 48.5,3.5 19.5,13.5 22.5,5 53,17 44,17 13.57,5.7 4.12,5.14 32.9,11.8 44,8 26.5,13 35.08,14.99 37.58,14.99
  pour Top (isolate 0.24): 0.5,0.5 62.5,0.5 62.5,19.62 31.22,19.62 29.48,17.87 20.87,17.87 17.5,14.5 0.5,14.5
  pour Bottom (isolate 0.254): 0.5,0.5 62.5,0.5 62.5,19.57 31.24,19.57 29.57,17.89 20.94,17.89 17.51,14.46 0.49,14.46 0.49,0.49
GND5  (via drill 0.35, 0.35 pad 0.2, 0.4 pad 0.8, 0.45 pad 1.2)
  Top 0.152: v29.07,42 28.94,41.87 C11.1
  Top 0.203: 52.5,43.37 U7.4 53.88,43.63 C16.2 | 52.5,43.37 51.99,43.37 | 51.99,43.37 C29.2 | C27.2 51.98,43.38 51.99,43.37 | C30.1 52.12,34 v56.5,34 | 46.88,29 47.69,29.81 | 47.69,29.81 C28.1 | 47.69,29.81 48.11,29.81 v48.42,29.5 | 52.5,43.37 52.5,42.1 v52.08,41.69 | U1.44 38.58,44.78 37.87,45.5
  Top 0.254: U1.47 37.08,44.67 C10.2 | 42.88,22.97 43,22.84 | 42.35,41.84 U1.35 44.84,41.84 45,42 45,44.88 C25.2 | U1.8 34,38.84 33.12,39.72 C13.1 32.78,39.72 | R6.1 27.79,60.86 27.79,58.72 | C24.1 41.12,30.12 42.46,31.46 42.46,32.96 41.58,33.84 U1.23
  Top 0.305: C26.2 32.12,27.5 30.5,27.5 v29.5,28.5 | v21.5,32 18.77,32 C5.2 | C9.2 38.75,48.5 v39,48.5
  Top 0.406: U8.16 30.39,22.84 28.84,22.84 26,20 19.5,20 v19,19.5 | C9.2 37.87,47.62 37.87,45.5 C10.2 | U5.4 16.3,60.3 16.5,60.5 16.5,65.28 C15.2 | 18.88,70.5 C20.2 | C8.2 15.5,18.9 15.5,18.5 14,18.5 C7.2 | C3.2 24.2,48.09 C14.2 | 43,22.84 U8.9 | U9.2 25.5,79.5 25,80 25,82.5 25.5,83 27.56,83 C19.1 | C4.2 v22.37,40.87 25,38.24 25,37 23.15,35.15 U3.4
  Top 0.508: C13.1 C12.1 C11.1 | IC1.4 27.79,58.72 25.72,58.72 v25.5,58.5 | U2.2 7.39,33.56 6.99,33.96 3.96,33.96 3.46,33.46 | C4.2 20.69,42.55 C3.2 | C5.2 18.93,33.08 U3.4 18.93,36.03 15.86,39.1 10.78,39.1 9.76,40.12 4.56,40.12 3.46,39.02 3.46,38.5 3.46,37.82 C2.2 | U6.4 12.37,70.13 13.99,68.5 16.88,68.5 | 18,18.5 v19,19.5 | R4.1 19,58 19.5,58.5 v20.5,58.5 | C1.2 3.46,30.5 | C19.1 27.57,86.59 LED1.K
  Top 0.61: 30.39,22.84 C18.2 | 18,18.5 15.5,18.5 11.41,18.5 U4.3 | C16.2 53.84,45 | C15.2 16.88,65.9 16.88,68.5 18.88,70.5
  Top 0.813: C22.2 C20.2 | R19.2 I/O4.MP R20.2 | U4.3 3.46,22.61 3.46,30.5 3.46,33.46 3.46,38.5
  Bottom 0.203: v48.42,29.5 52,29.5 v56.5,34 56.5,40 54.81,41.69 v52.08,41.69
  Bottom 0.305: v29.5,28.5 26,32 v21.5,32 | v39,48.5 40.17,49.67 JP2.5
  Bottom 0.508: v20.5,58.5 v25.5,58.5
  Bottom 0.61: v22.37,40.87 23.5,42 v29.07,42
  other vias: 21.5,28.5 56.5,73 51.5,73 54.5,26 54.5,29.5 45.5,36 46.5,68 56.5,68 51.5,68 54.5,23 5.62,76 61.5,23 61.5,28 61.5,33 61.5,38 61.5,43 61.5,48 61.5,53 61.5,58 61.5,63 61.5,68 61.5,73 61.5,78 61.5,83 61.5,88 61.5,91 56.5,91 51.5,91 46.5,91 41.5,91 36.5,91 31.5,91 26.5,91 21.5,91 16.5,91 11.5,91 6.5,91 1.5,91 1.5,86 1.5,81 1.5,76 1.5,71 1.5,66 1.5,61 1.5,56 1.5,51 1.5,46 1.5,41 1.5,36 1.5,31 1.5,26 1.5,21 5.5,17 13,76 41.5,88 51.5,88 46.5,83 46.5,88 46.5,73 50,42.5 43.04,34.53 39.26,39.51 28.26,68.01 51.5,83 35.17,44.06 30.13,44.12 23.13,44.12 13.51,41.98 10.4,35.3 11.05,66.6 13.92,68.5 5.92,46 4.42,33 13.42,32.5 27.46,25.64 46.46,24.64 41.5,73 30,51.5 34,51.7 25.64,50.86 14.99,63.85 18.02,84.69 35.11,30.07 38.17,28.96 39.19,26.67 39.06,46.6 56.5,83 13.59,85.46 29.09,21.46 23.44,35.38 41.18,45.83 9,81 22,78.5 32.5,81 20.56,51.55 21.63,63.91 19.8,68.35 9.56,28.41 57.92,39 46.5,78 56.5,88 14.62,25.14 16.62,55.14 50.61,37.25 14.5,17 6.59,85.71 41.5,78 56.5,78 32.88,41.63 41.5,68 41.5,83 13.5,88.5 19.09,88.46 56.5,53 51.5,53 46.5,53 36.5,58 46.5,58 41.5,58 51.5,58 56.5,58 56.5,63 51.5,63 46.5,63 41.5,63 36.5,63 36.5,68 36.5,73 36.5,78.5 36.5,83 36.5,88
  pour Top (isolate 0.254): 0.5,16 17,16 20.25,19.25 28.74,19.25 30.74,21.25 62.5,21.25 62.5,92 0.5,92
  pour Bottom (isolate 0.254): 0.5,16 17,16 20.29,19.29 28.81,19.29 30.73,21.2 62.5,21.2 62.5,92 0.5,92
LED
  Top 0.254: U1.41 40.08,48.52
  Top 0.305: R9.2 35,82.97 35,56.1 40.08,51.02 40.08,48.52
LSP1
  Top 0.508: R1.2 4.58,63.42 I/O2.MP
  Bottom 0.813: R25.1 5.05,62.95 I/O2.MP
LSP2
  Top 0.254: U5.3 13.45,60.95 12.81,60.31 12.81,54.31 12.15,53.65 10.57,53.65
  Top 0.305: 10.57,53.65 R2.1
  Top 0.508: I/O1.MP 4.47,53.35 R18.2 10.27,53.35 R2.1
  Bottom 1.016: I/O1.MP 4.77,53.65 R25.2
LSP3
  Top 0.254: U9.3 24.45,78.55 23.35,79.65
  Top 0.305: R8.1 16.44,89.5 | 16.44,89.5 10,89.5 8.35,87.85 D1.1 | 16.44,89.5 20.5,89.5 | 20.5,89.5 21,89 R24.1 | 20.5,89.5 22,89.5 23.35,88.15 23.35,79.65
  Top 0.813: R19.1 I/O3.MP 7.95,87.5 D1.1
LSP5
  Top 0.254: U6.6 16.13,71.86 15.73,71.46 15.73,70.73 15.5,70.5 13.67,70.5 13.45,70.72 13.45,72.09 13.03,72.5 U6.2
  Top 0.305: U6.2 4,72.5
  Top 0.813: R20.1 4,72.5 I/O5.MP
MISO_EXT
  Top 0.254: JP1.13 24.55,10.54 24.37,10.72 24.37,12.5 IC2.5
  Top 1.016: JP1.14 JP1.13
MOSI_EXT
  Top 0.305: JP1.7 35.7,7 R21.7
  Top 1.016: JP1.7 JP1.8
N$1
  Top 0.305: R9.1 31.53,84.73 LED1.A
N$2
  Top 0.254: UIN.TP R18.1 | U5.2 12.6,61.59 11.58,60.58 R1.1
  Top 0.508: R1.1 10.5,56.5 | 10.5,56.5 R2.2 | R18.1 10.35,56.65 10.5,56.5
N$3  (via drill 0.35)
  Top 0.203: U7.2 56.69,40.69 v55.5,39.5 | v52,38 R10.1
  Bottom 0.203: v55.5,39.5 54,38 v52,38
N$4
  Top 0.254: 19.35,60.98 21.5,60.98 | TP11.TP 21.83,61.31 21.5,60.98 | 21.5,60.98 24.33,60.98 R5.2
  Top 0.406: U5.6 19.35,60.98
N$6
  Top 0.254: IC1.5 21.14,56.63 19.65,55.15 R4.2
  Top 0.305: R3.1 19,52.03 R4.2
N$7
  Top 0.508: U3.5 18.93,42.51 C4.1
N$8
  Top 0.254: IC1.6 23.86,55.37 24.5,56 24.5,57 23.5,58 | 23.5,58 21.2,60.3 U5.5 | REF.TP 23.5,58
  Top 0.508: IC1.6 IC1.7
N$9
  Top 0.305: R21.1 41.59,15.05 U8.8
N$11  (via drill 0.35)
  Top 0.254: 13.98,87.09 v14.03,87.04
  Top 0.305: R7.1 7.5,83 7.1,83.4 7.1,84.6 7.5,85 10.5,85 11.75,86.25 D1.2 13.98,87.09 | CR1.6 20.34,80.34 21,81 V-.TP R24.2 19.86,86.15 v18.98,87.03
  Bottom 0.305: v18.98,87.03 v18.97,87.04 v14.03,87.04
N$12
  Top 0.254: 9.96,82.89 R7.2
  Top 0.305: 9.96,82.89 12.5,82.89 | R8.2 16.44,84.44 14.88,82.89 13,82.89
  Top 0.508: 13,82.89 12.5,82.89 ADJ.TP | 13,82.89 CR1.1 13.94,83.56 12.94,83.56 ADJ.TP | ADJ.TP 13,83.5 13,82.89
N$13
  Top 0.203: R13.2 48.52,35.83 SCK2.TP 49.72,35.88 C30.2 52.88,35 55,35 55.41,35.41 U7.6
N$14
  Top 0.203: R14.2 48.5,40 | 48.5,40 49.62,40 C29.1 52.88,39.62 54.15,38.35 U7.5 | MOSI2.TP 48.5,41.98 48.5,40
N$15
  Top 0.203: R15.1 49.88,34 C28.2 50.12,33.88 52,32 59,32 59.5,32.5 59.5,41.82 U7.1
N$16
  Top 0.305: R21.2 35.7,10.71 39.05,14.05 U8.6
N$17
  Top 0.305: R21.3 34.89,11.39 36.52,13.02 U8.4
N$18
  Top 0.305: U8.2 34.08,17.29 R21.4
N$19
  Top 0.254: R17.1 35.23,27.5 34.5,27.5 | IC2.3 23.1,25.1 25.5,27.5 29,27.5
  Top 0.305: 29,27.5 30,26.5 33.5,26.5 34.5,27.5 34.5,27.88 C26.1
OP1
  Top 0.254: R5.1 R6.2 29.65,62.85 30.75,61.75 OP1.TP 30.75,56.25 29.86,55.37 IC1.3
RST  (via drill 0.35)
  Top 0.203: 34,44 34,39.5 34.16,39.34 U1.7
  Top 0.305: v37,52.5 34,49.5 34,46.5 | 34,46.5 34,44 | R11.1 34,46.5
  Bottom 0.305: JP2.4 46.18,51.32 45,52.5 v37,52.5
SCLK_EXT
  Top 0.305: JP1.9 34.89,7.18 R21.6
  Top 1.016: JP1.10 JP1.9
SF_EXT
  Top 0.305: JP1.11 33.25,8.08 R21.5
  Top 1.016: JP1.11 JP1.12
SF_INT  (via drill 0.35)
  Top 0.254: R22.1 30.86,28.32 | 35,25.91 SF.TP
  Top 0.305: 30.86,28.32 v30.84,28.3 | 35,25.91 v35,25 35.24,24.75 U8.14
  Bottom 0.254: v30.84,28.3 34.15,25 v35,25
SPI1_MISO
  Top 0.203: 37.93,31.94 R17.2
  Top 0.254: R17.2 37.97,32.97 38.08,33.08 U1.16 | MISO1.TP 37.93,31.94
SPI1_MOSI  (via drill 0.35 pad 0.25)
  Top 0.203: 38.1,27.68 MOSI1.TP
  Top 0.254: U8.12 v37.78,26.29 38.1,26.6 38.1,27.68 39.23,28.81 39.23,32.77 38.58,33.42 U1.17
  Top 0.305: R22.3 v32.24,31.23 | v32.24,31.23
  Bottom 0.254: v32.24,31.23 32.24,28.81 34.78,26.27 37.77,26.27
  Bottom 0.305: 37.77,26.27 v37.78,26.29
SPI1_NSS  (via drill 0.35 pad 0.25)
  Top 0.254: U8.11 39.05,24.39 NSS1.TP 40.11,33.39 v40,33.5 39.08,34.42 U1.18
  Top 0.305: R22.4 33.04,32.04 v34.5,33.5
  Bottom 0.254: v34.5,33.5 v40,33.5
SPI1_SCK  (via drill 0.35)
  Top 0.203: 37.58,33.58 v36.5,32.5
  Top 0.254: v36.5,32.5 34.41,30.41 34,30.41 | 34,30.41 R22.2 | SCK1.TP 34,29.95 34,30.41 | v36.5,27.5 36.5,22.86 U8.13 | U1.15 37.58,33.58
  Bottom 0.254: v36.5,27.5 v36.5,32.5
SPI2_MISO
  Top 0.203: U1.27 46.49,37.84 R10.2 47.4,38.75 47.4,40.66 47,41.06 47,41.5 | C27.1 47,41.5 | MISO2.TP 46.59,41.5 47,41.5
SPI2_MOSI
  Top 0.203: U1.28 44.99,38.34 R14.1
SPI2_NSS
  Top 0.203: U1.25 45.33,35.05 NSS2.TP 46.63,33.98 R15.2
SPI2_SCK
  Top 0.203: U1.26 45.31,37.34 R13.1
SS_EXT
  Top 0.305: R21.8 37.17,8.08 JP1.5 38.97,6.28 R16.1
  Top 0.813: JP1.5 JP1.6
SWCLK
  Top 0.203: JP2.3 48.72,48.72 47.5,47.5 43,47.5 42.08,46.58 U1.37
SWDIO
  Top 0.203: JP2.2 46,44.41 46,42 45.34,41.34 U1.34
V+  (via drill 0.35)
  Top 0.2: C13.2 33.47,37.97 33.84,38.34 U1.9
  Top 0.406: C12.2
  Top 0.508: v23.5,38 18.5,38 17.66,38.84 U3.6 17.66,43.29 17.68,43.32 C3.1 18.94,50.22
  Top 0.61: v27,38 28.91,38 C11.2 C12.2 | C12.2 C13.2 | 3V.TP 17,44 17.68,43.32 | R3.2 18.94,50.22
  Bottom 0.508: v23.5,38 v27,38

### Text on the board
Top: blame Timo Erdmannsdörfer | and partly Johannes Wittmann
tPlace: Gnd | Nrst | CLK | DIO | 3,3V
PART: Steckkarte Messbox 2000 v1.0